# Altium project AS5600.PrjPcb
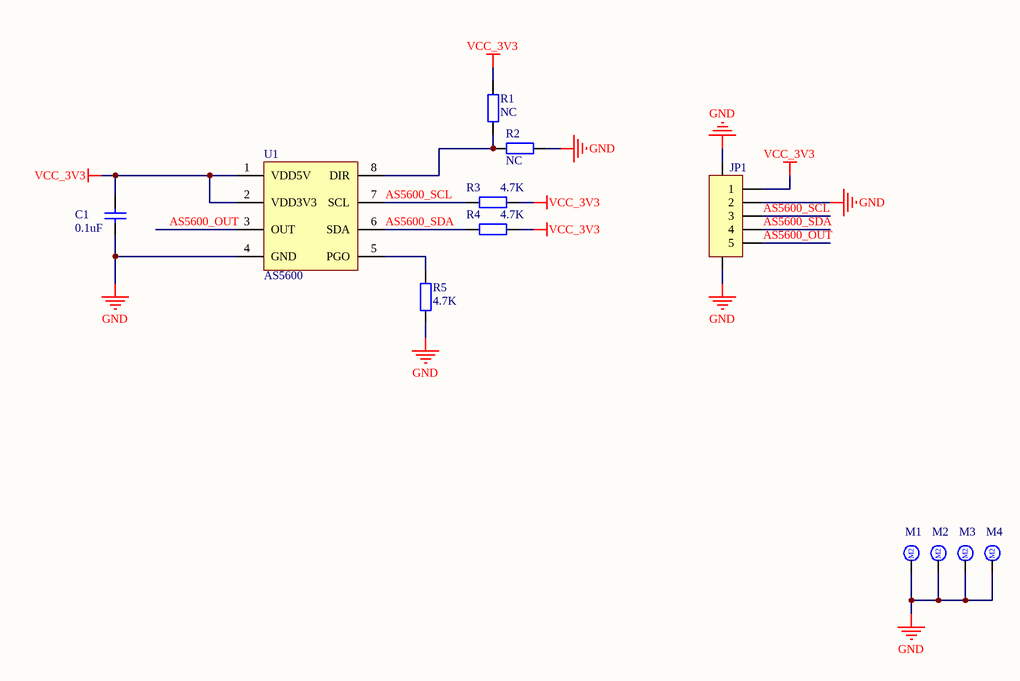
[diagram p0: AS5600.SchDoc]
1 sheet, 12 parts. Net scope: global (net labels, ports and power ports of the same name join across sheets).
Board file: AS5600_V1.1.PcbDoc

## Sheet AS5600.SchDoc
size A4; SheetNumber: 1; SheetTotal: 1

### Parts
C1  0.1uF  [C0402_L]
JP1  CON-5P  [SH1.0-WT-5P]  (value not drawn)
M1  M2.5  [M2.5]  (value not drawn)
M2  M2.5  [M2.5]  (value not drawn)
M3  M2.5  [M2.5]  (value not drawn)
M4  M2.5  [M2.5]  (value not drawn)
R1  NC  [R0402_L]
R2  NC  [R0402_L]
R3  4.7K  [R0402_L]
R4  4.7K  [R0402_L]
R5  4.7K  [R0402_L]
U1  AS5600  [SOIC-8L]

### Nets
GND: C1.1 JP1.0 JP1.2 M1.1 M2.1 M3.1 M4.1 R2.1 R5.2 U1.4(GND)
VCC_3V3: C1.2 JP1.1 R1.2 R3.1 R4.1 U1.1(VDD5V) U1.2(VDD3V3)
AS5600_OUT: JP1.5 U1.3(OUT)
AS5600_SCL: JP1.3 R3.2 U1.7(SCL)
AS5600_SDA: JP1.4 R4.2 U1.6(SDA)
NetR1_1: R1.1 R2.2 U1.8(DIR)
NetR5_1: R5.1 U1.5(PGO)

### Notes on the sheet
- (in symbol M2系列) M2

### Library data of the parts
C1 = C: 贴片电容; BOM名称: 无极性贴片电容; 联系卖家，免费查找封装: 唯一出售店铺网址https://shop463601444.taobao.com
JP1 = Header 5: 5P连接器; 联系卖家 免费查找封装: 唯一出售店铺网址https://shop463601444.taobao.com; 联系卖家 免费技术支持: 封装库来自淘宝卖家ID：黄晶宝石; BOM名称: 5P连接器
M1-M4 = M2系列: M2孔支撑柱
R1-R5 = R: 贴片电阻; 联系卖家，免费查找封装: 唯一出售店铺网址https://shop463601444.taobao.com; BOM名称: 贴片电阻
U1 = AS5600: 12bit 磁编码器